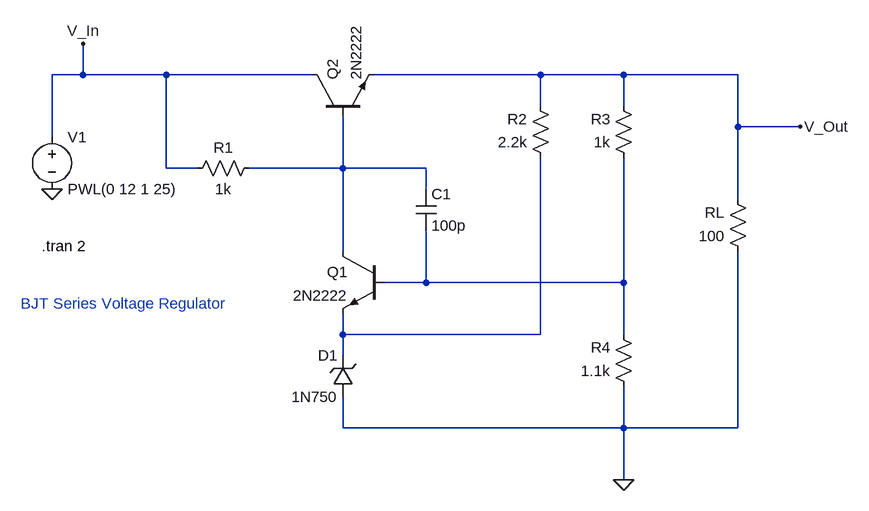
[diagram p0: schematic Voltage_Regulator.asc]
Voltage_Regulator.asc, the LTspice schematic file:
Version 4.1
SHEET 1 880 680
WIRE -320 -128 -320 -176
WIRE -320 -128 -368 -128
WIRE -192 -128 -320 -128
WIRE 32 -128 -192 -128
WIRE 384 -128 128 -128
WIRE 512 -128 384 -128
WIRE 688 -128 512 -128
WIRE 384 -80 384 -128
WIRE 512 -80 512 -128
WIRE 688 -48 688 -128
WIRE 784 -48 688 -48
WIRE -368 -32 -368 -128
WIRE -192 16 -192 -128
WIRE -144 16 -192 16
WIRE 80 16 80 -64
WIRE 80 16 -64 16
WIRE 208 16 80 16
WIRE 208 48 208 16
WIRE 688 64 688 -48
WIRE 80 144 80 16
WIRE 208 192 208 112
WIRE 208 192 144 192
WIRE 512 192 512 0
WIRE 512 192 208 192
WIRE 80 272 80 240
WIRE 384 272 384 0
WIRE 384 272 80 272
WIRE 512 272 512 192
WIRE 80 304 80 272
WIRE 80 416 80 368
WIRE 512 416 512 352
WIRE 512 416 80 416
WIRE 688 416 688 144
WIRE 688 416 512 416
WIRE 512 496 512 416
FLAG -368 48 0
FLAG 512 496 0
FLAG -320 -176 V_In
FLAG 784 -48 V_Out
SYMBOL npn 144 144 M0
SYMATTR InstName Q1
SYMATTR Value 2N2222
SYMBOL npn 32 -64 R270
SYMATTR InstName Q2
SYMATTR Value 2N2222
SYMBOL cap 192 48 R0
SYMATTR InstName C1
SYMATTR Value 100p
SYMBOL res -48 0 R90
WINDOW 0 0 56 VBottom 2
WINDOW 3 32 56 VTop 2
SYMATTR InstName R1
SYMATTR Value 1k
SYMBOL res 400 16 R180
WINDOW 0 36 76 Left 2
WINDOW 3 36 40 Left 2
SYMATTR InstName R2
SYMATTR Value 2.2k
SYMBOL res 528 16 R180
WINDOW 0 36 76 Left 2
WINDOW 3 36 40 Left 2
SYMATTR InstName R3
SYMATTR Value 1k
SYMBOL res 528 368 R180
WINDOW 0 36 76 Left 2
WINDOW 3 36 40 Left 2
SYMATTR InstName R4
SYMATTR Value 1.1k
SYMBOL res 704 160 R180
WINDOW 0 36 76 Left 2
WINDOW 3 36 40 Left 2
SYMATTR InstName RL
SYMATTR Value 100
SYMBOL zener 96 368 R180
WINDOW 0 24 64 Left 2
WINDOW 3 24 0 Left 2
SYMATTR InstName D1
SYMATTR Value 1N750
SYMBOL voltage -368 -48 R0
WINDOW 123 0 0 Left 0
WINDOW 39 0 0 Left 0
SYMATTR InstName V1
SYMATTR Value PWL(0 12 1 25)
TEXT -384 136 Left 2 !.tran 2
TEXT -416 224 Left 2 ;BJT Series Voltage Regulator

The netlist it stands for:
* Voltage_Regulator.asc
Q1 N001 N002 N003 0 2N2222
Q2 V_In N001 V_Out 0 2N2222
C1 N001 N002 100p
R1 N001 V_In 1k
R2 N003 V_Out 2.2k
R3 N002 V_Out 1k
R4 0 N002 1.1k
RL 0 V_Out 100
D1 0 N003 1N750
V1 V_In 0 PWL(0 12 1 25)
.model D D
.lib standard.dio
.model NPN NPN
.model PNP PNP
.lib standard.bjt
.tran 2
* BJT Series Voltage Regulator
.backanno
.end